# Altium schematic sheet 2um_Homodyne.SchDoc
size A4
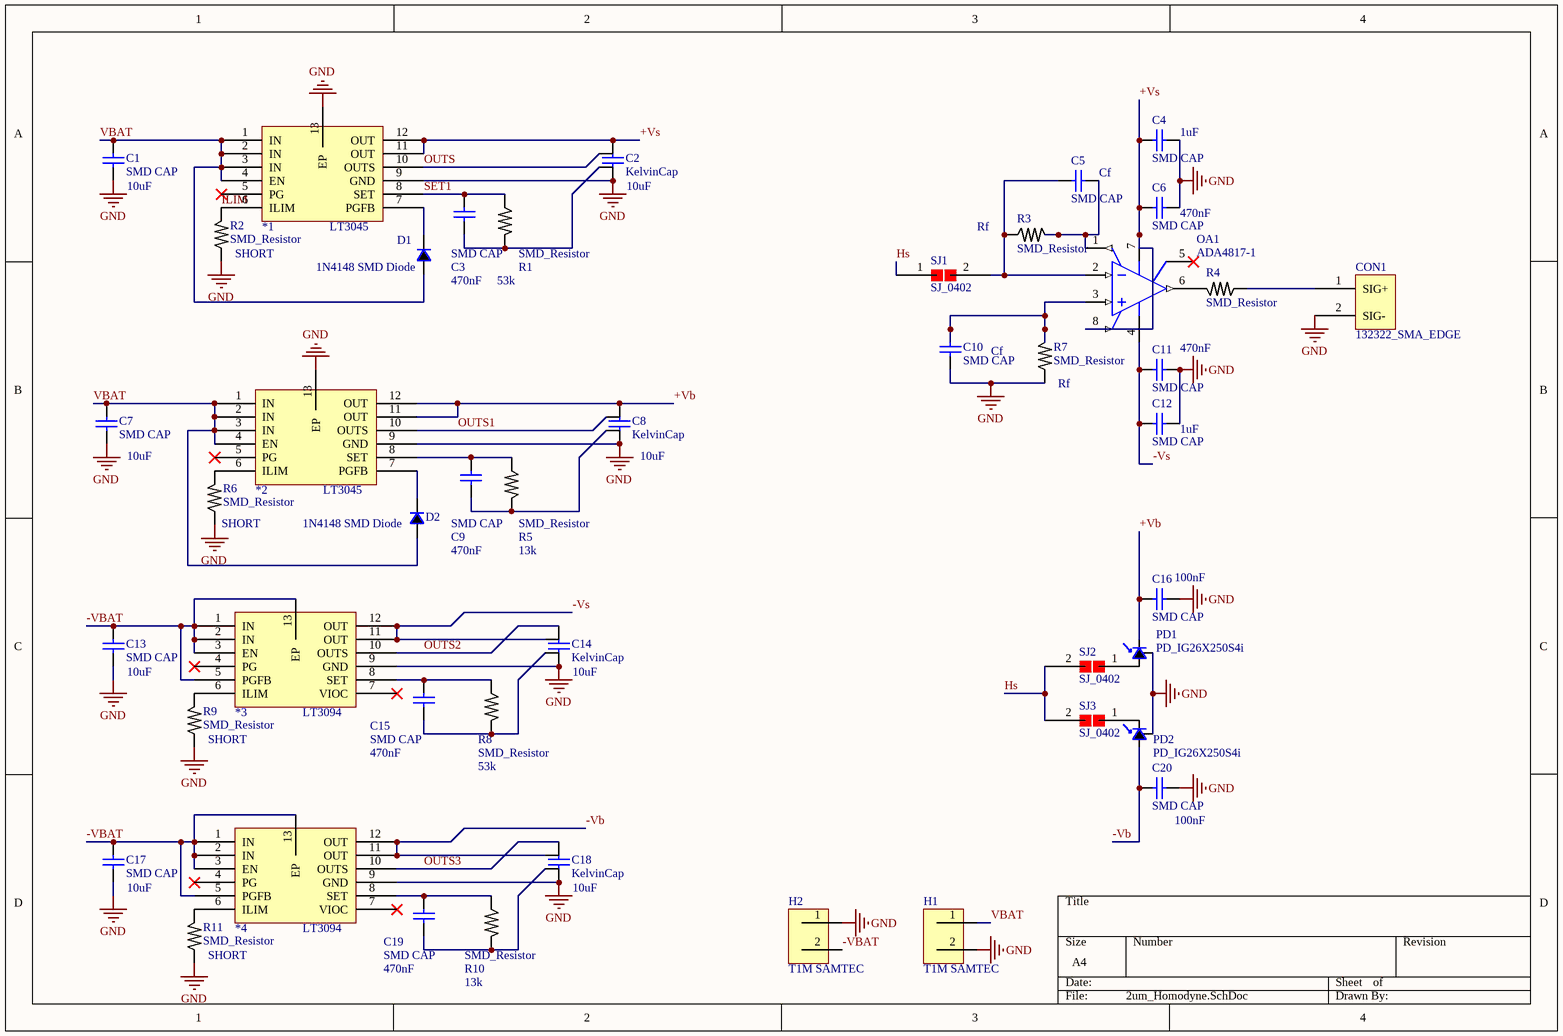
[diagram p0: 2um_Homodyne.SchDoc]

## Parts
*1  LT3045  [LT3045/3094]
*2  LT3045  [LT3045/3094]
*3  LT3094  [LT3045/3094]
*4  LT3094  [LT3045/3094]
C1  SMD CAP  Capacitance: 10uF  [1206CAP]
C2  KelvinCap  Capacitance: 10uF  [Kelvin1206]
C3  SMD CAP  Capacitance: 470nF  [0805CAP]
C4  SMD CAP  Capacitance: 1uF  [0402CAP]
C5  SMD CAP  Feedback capacitance: Cf  [0402CAP]
C6  SMD CAP  Capacitance: 470nF  [0402CAP]
C7  SMD CAP  Capacitance: 10uF  [1206CAP]
C8  KelvinCap  Capacitance: 10uF  [Kelvin1206]
C9  SMD CAP  Capacitance: 470nF  [0805CAP]
C10  SMD CAP  Capacitance: Cf  [0402CAP]
C11  SMD CAP  Capacitance: 470nF  [0402CAP]
C12  SMD CAP  Capacitance: 1uF  [0402CAP]
C13  SMD CAP  Capacitance: 10uF  [1206CAP]
C14  KelvinCap  Capacitance: 10uF  [Kelvin1206]
C15  SMD CAP  Capacitance: 470nF  [0805CAP]
C16  SMD CAP  Capacitance: 100nF  [0402CAP]
C17  SMD CAP  Capacitance: 10uF  [1206CAP]
C18  KelvinCap  Capacitance: 10uF  [Kelvin1206]
C19  SMD CAP  Capacitance: 470nF  [0805CAP]
C20  SMD CAP  Capacitance: 100nF  [0402CAP]
CON1  132322_SMA_EDGE  [SMA_EDGE]
D1  1N4148 SMD Diode  [1N4148_SMD DIODE]
D2  1N4148 SMD Diode  [1N4148_SMD DIODE]
H1  T1M SAMTEC  [Mini_Header]
H2  T1M SAMTEC  [Mini_Header]
OA1  ADA4817-1  [ADA4817-SOP]
PD1  PD_IG26X250S4i  [IG26X250S4i]
PD2  PD_IG26X250S4i  [IG26X250S4i]
R1  SMD_Resistor  Resistance: 53k  [SMD_RES_0402]
R2  SMD_Resistor  Resistance: SHORT  [SMD_RES_0402]
R3  SMD_Resistor  Feedback resistance: Rf  [SMD_RES_0402]
R4  SMD_Resistor  [SMD_RES_0402]
R5  SMD_Resistor  Resistancce: 13k  [SMD_RES_0402]
R6  SMD_Resistor  Resistanace: SHORT  [SMD_RES_0402]
R7  SMD_Resistor  Resistance: Rf  [SMD_RES_0402]
R8  SMD_Resistor  Resistance: 53k  [SMD_RES_0402]
R9  SMD_Resistor  Resistance: SHORT  [SMD_RES_0402]
R10  SMD_Resistor  Resistance: 13k  [SMD_RES_0402]
R11  SMD_Resistor  Resistance: SHORT  [SMD_RES_0402]
SJ1  SJ_0402  [Solder_Jumper]
SJ2  SJ_0402  [Solder_Jumper]
SJ3  SJ_0402  [Solder_Jumper]

## Nets
GND: *1.9(GND) *1.13(EP) *2.9(GND) *2.13(EP) *3.9(GND) *4.9(GND) C1.1 C2.3 C4.2 C6.2 C7.1 C8.3 C10.1 C11.2 C12.2 C13.1 C14.3 C16.2 C17.2 C18.3 C20.2 CON1.2(SIG-) H1.2 H2.1 PD1.2(GND/CASE) PD2.2(GND/CASE) R2.1 R6.1 R7.1 R9.1 R11.1
+Vb: *2.11(OUT) *2.12(OUT) C8.1 C16.1 PD1.3(Cathode)
+Vs: *1.11(OUT) *1.12(OUT) C2.1 C4.1 C6.1 OA1.7(+VS) OA1.8(~{PD})
-Vb: *4.11(OUT) *4.12(OUT) C18.2 C20.1 PD2.1(Anode)
-VBAT: *3.1(IN) *3.2(IN) *3.3(EN) *3.5(PGFB) *3.13(EP) *4.1(IN) *4.2(IN) *4.3(EN) *4.5(PGFB) *4.13(EP) C13.2 C17.1 H2.2
-Vs: *3.11(OUT) *3.12(OUT) C11.1 C12.1 C14.2 OA1.4(-VS)
Hs: SJ1.1 SJ2.2 SJ3.2
ILIM: *1.6(ILIM) R2.2
OUTS: *1.10(OUTS) C2.2
OUTS1: *2.10(OUTS) C8.2
OUTS2: *3.10(OUTS) C14.1
OUTS3: *4.10(OUTS) C18.1
SET1: *1.8(SET) C3.2 R1.1
VBAT: *1.1(IN) *1.2(IN) *1.3(IN) *1.4(EN) *2.1(IN) *2.2(IN) *2.3(IN) *2.4(EN) C1.2 C7.2 D1.2 D2.2 H1.1
Net*1_7: *1.7(PGFB) D1.1
Net*2_6: *2.6(ILIM) R6.2
Net*2_7: *2.7(PGFB) D2.1
Net*2_8: *2.8(SET) C9.2 R5.1
Net*3_6: *3.6(ILIM) R9.2
Net*3_8: *3.8(SET) C15.2 R8.1
Net*4_6: *4.6(ILIM) R11.2
Net*4_8: *4.8(SET) C19.2 R10.1
NetC2_4: C2.4 C3.1 R1.2
NetC5_1: C5.1 OA1.2(-IN) R3.1 SJ1.2
NetC5_2: C5.2 OA1.1(FB) R3.2
NetC8_4: C8.4 C9.1 R5.2
NetC10_2: C10.2 OA1.3(+IN) R7.2
NetC14_4: C14.4 C15.1 R8.2
NetC18_4: C18.4 C19.1 R10.2
NetCON1_1: CON1.1(SIG+) R4.1
NetOA1_6: OA1.6(OUT) R4.2
NetPD1_1: PD1.1(Anode) SJ2.1
NetPD2_3: PD2.3(Cathode) SJ3.1

Not connected (* = marked no-connect by the designer): *1 5(PG)*; *2 5(PG)*; *3 4(PG)* 7(VIOC)*; *4 4(PG)* 7(VIOC)*; OA1 5(NC)*

## Library data of the parts
D1 D2 = 1N4148 SMD Diode: RS: 761-3476
H1 H2 = Mini_Header
C1 C3-C7 C9-C13 C15-C17 C19 C20 = SMD CAP
  C1 C4 C6 C7 C10 C12 C13: Parameter 1: *
C2 C8 C14 C18 = KelvinCap
  C8 C14: Parameter 1: *
R1-R11 = SMD_Resistor
  R1 R2 R6 R8 R9: Parameter 1: *